# EAGLE design CHAIRCONTROLMOTORS (EAGLE 9.5.1)

## Sheet 1 of 2
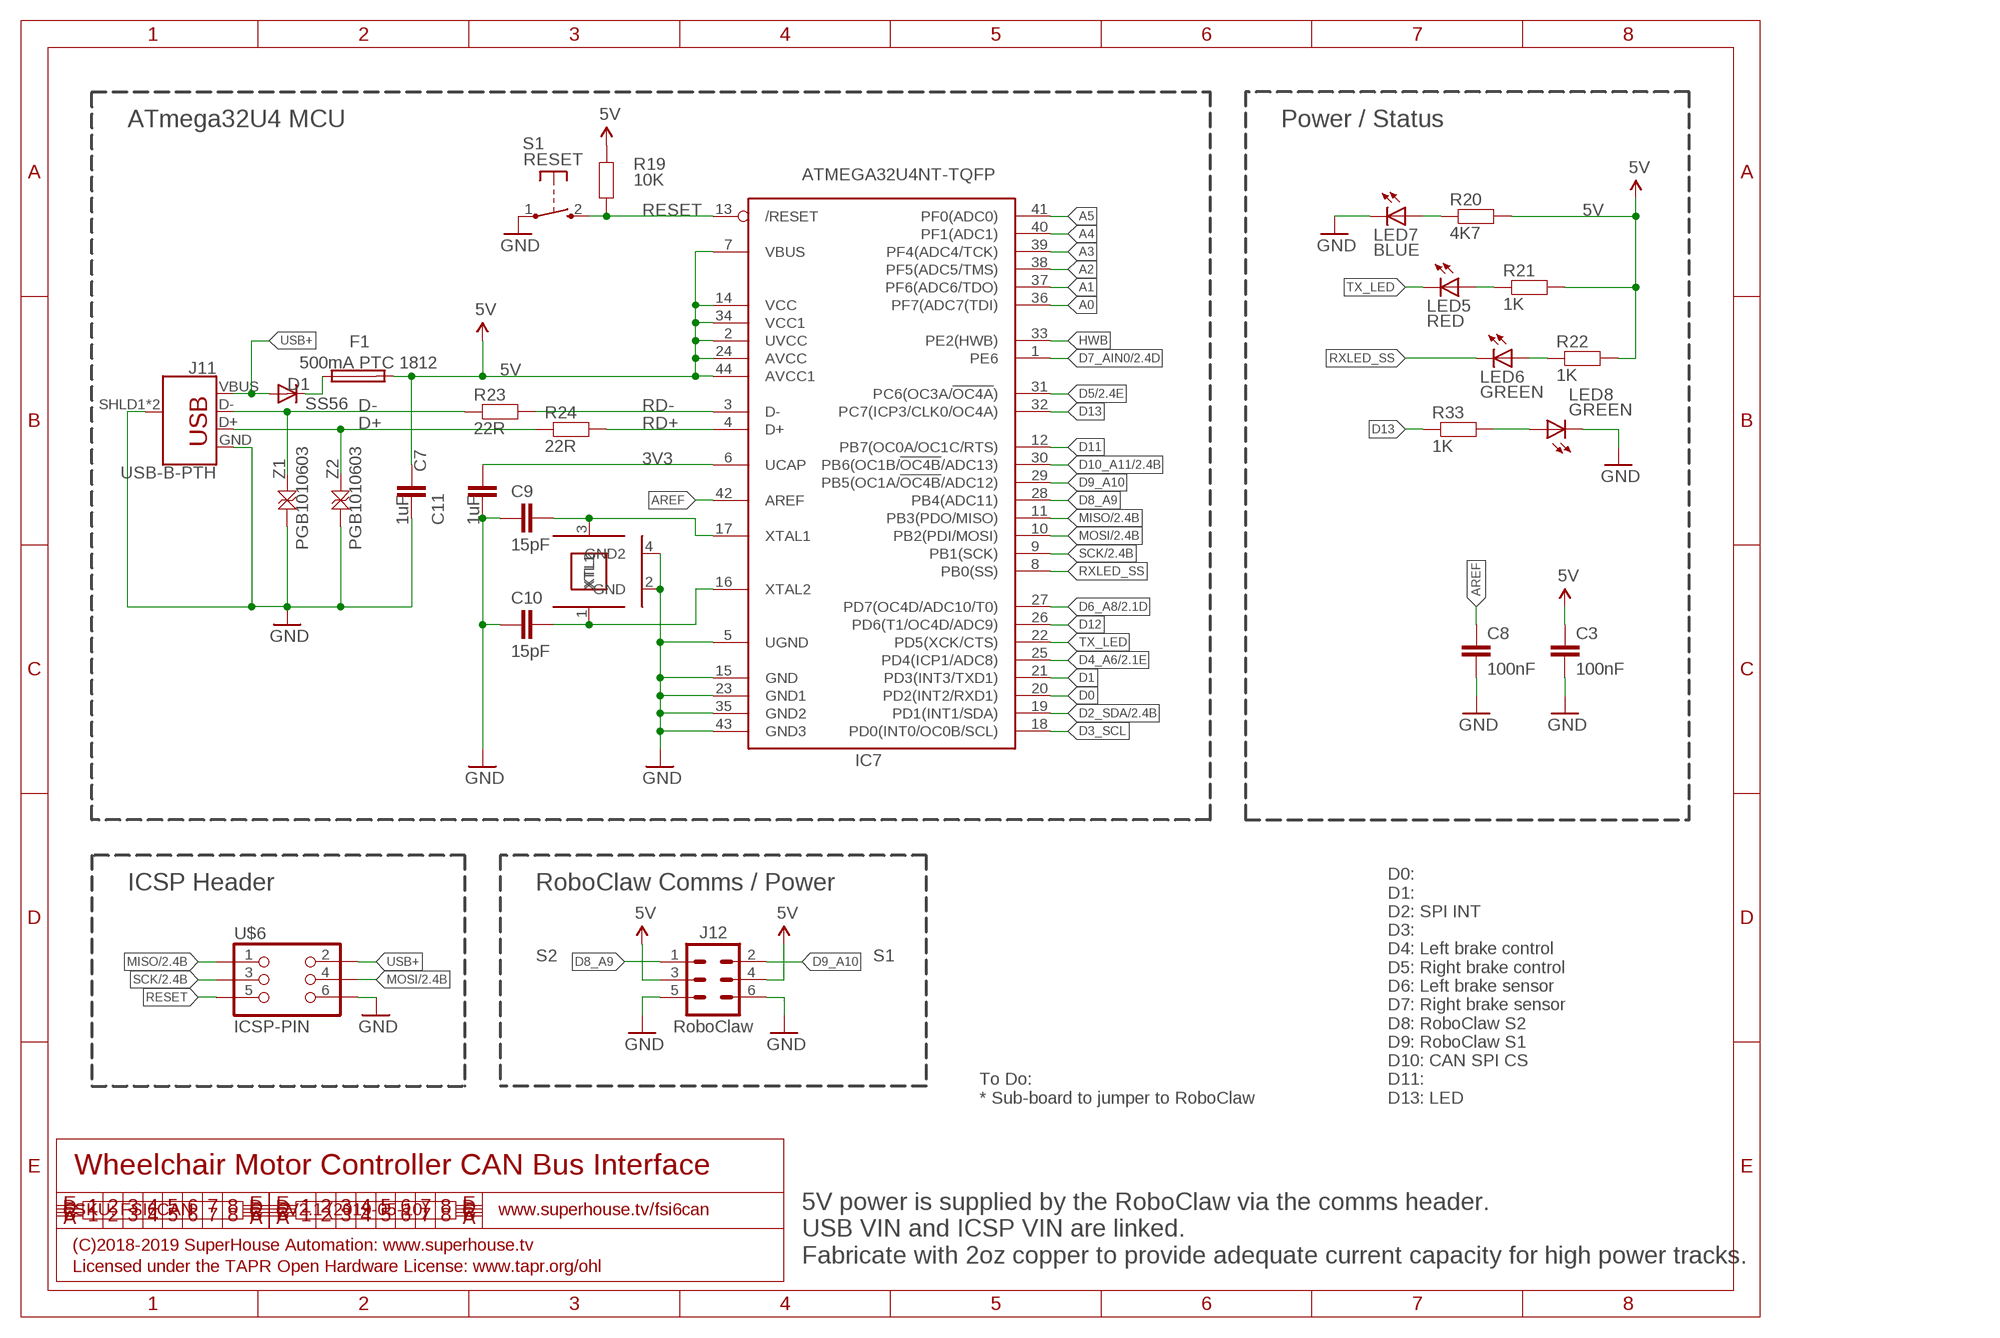
[diagram p0: schematic, sheet 1]

### Parts
C3  100nF  CAP0603  [C0603]
C7  1uF  CAP0603  [C0603]
C8  100nF  CAP0603  [C0603]
C9  15pF  CAP0603  [C0603]
C10  15pF  CAP0603  [C0603]
C11  1uF  CAP0603  [C0603]
D1  SS56  DIODESMA  [SMA-DIODE]
F1  500mA PTC 1812  PTC050  [1812]
IC7  ATMEGA32U4NT-TQFP  [TQFP44]
J11  USB-B-PTH  [USB-B-PTH]
J12  RoboClaw  M02X3-PIN  [2X03-P]
LED5  RED  LED0603  [LED-0603]
LED6  GREEN  LED0603  [LED-0603]
LED7  BLUE  LED0603  [LED-0603]
LED8  GREEN  LED0603  [LED-0603]
R19  10K  RESISTOR0603  [R0603]
R20  4K7  RESISTOR0603  [R0603]
R21  1K  RESISTOR0603  [R0603]
R22  1K  RESISTOR0603  [R0603]
R23  22R  RESISTOR0603  [R0603]
R24  22R  RESISTOR0603  [R0603]
R33  1K  RESISTOR0603  [R0603]
S1  RESET  TAC_SWITCH_2PINSMT  [TACTILE_SMT_3X4X2]
U$6  ICSP-PIN  [2X03-ICSP]
XTL2  16MHz  CRYSTAL-GND3X2  [CRYSTAL-SMD-3X2]
Z1  PGB1010603  TVS0603  [TVS0603]
Z2  PGB1010603  TVS0603  [TVS0603]

### Nets
3V3: C11.2 IC7.6(UCAP)
5V: C3.1 C7.1 F1.2 IC7.2(UVCC) IC7.7(VBUS) IC7.14(VCC) IC7.24(AVCC) IC7.34(VCC1) IC7.44(AVCC1) J12.3 J12.4 R19.2 R20.2 R21.2 R22.2 ; also sheet 2
A0: IC7.36(PF7(ADC7(TDI))
A1: IC7.37(PF6(ADC6/TDO))
A2: IC7.38(PF5(ADC5/TMS))
A3: IC7.39(PF4(ADC4/TCK))
A4: IC7.40(PF1(ADC1))
A5: IC7.41(PF0(ADC0))
AREF: C8.1 IC7.42(AREF)
D0: IC7.20(PD2(INT2/RXD1))
D1: IC7.21(PD3(INT3/TXD1))
D2_SDA: IC7.19(PD1(INT1/SDA)) ; also sheet 2
D3_SCL: IC7.18(PD0(INT0/OC0B/SCL))
D4_A6: IC7.25(PD4(ICP1/ADC8)) ; also sheet 2
D5: IC7.31(PC6(OC3A/!OC4A!)) ; also sheet 2
D6_A8: IC7.27(PD7(OC4D/ADC10/T0)) ; also sheet 2
D7_AIN0: IC7.1(PE6) ; also sheet 2
D8_A9: IC7.28(PB4(ADC11)) J12.1
D9_A10: IC7.29(PB5(OC1A/!OC4B!/ADC12)) J12.2
D10_A11: IC7.30(PB6(OC1B/!OC4B!/ADC13)) ; also sheet 2
D11: IC7.12(PB7(OC0A/OC1C/RTS))
D12: IC7.26(PD6(T1/OC4D/ADC9))
D13: IC7.32(PC7(ICP3/CLK0/OC4A)) R33.1
D+: J11.D+ R24.1 Z2.2
D-: J11.D- R23.1 Z1.2
GND: C3.2 C7.2 C8.2 C9.1 C10.1 C11.1 IC7.5(UGND) IC7.15(GND) IC7.23(GND1) IC7.35(GND2) IC7.43(GND3) J11.GND J11.SHLD1(SHIELD) J11.SHLD2(SHIELD) J12.5 J12.6 LED7.C LED8.C S1.1(P) U$6.6 XTL2.2(GND) XTL2.4(GND2) Z1.1 Z2.1 ; also sheet 2
HWB: IC7.33(PE2(HWB))
MISO: IC7.11(PB3(PDO/MISO)) U$6.1 ; also sheet 2
MOSI: IC7.10(PB2(PDI/MOSI)) U$6.4 ; also sheet 2
N$28: C9.2 IC7.17(XTAL1) XTL2.3(XTL2)
N$29: C10.2 IC7.16(XTAL2) XTL2.1(XTL1)
N$30: LED7.A R20.1
N$31: LED5.A R21.1
N$32: LED6.A R22.1
N$40: D1.C F1.1
N$43: LED8.A R33.2
RD+: IC7.4(D+) R24.2
RD-: IC7.3(D-) R23.2
RESET: IC7.13(/RESET) R19.1 S1.2(S) U$6.5
RXLED_SS: IC7.8(PB0(SS)) LED6.C
SCK: IC7.9(PB1(SCK)) U$6.3 ; also sheet 2
TX_LED: IC7.22(PD5(XCK/CTS)) LED5.C
USB+: D1.A J11.VBUS U$6.2

### Notes on the sheet
- ATmega32U4 MCU | Power / Status
- ICSP Header | RoboClaw Comms / Power
- S2 | S1
- To Do:
  * Sub-board to jumper to RoboClaw
- D0:
  D1:
  D2: SPI INT
  D3: 
  D4: Left brake control
  D5: Right brake control
  D6: Left brake sensor
  D7: Right brake sensor
  D8: RoboClaw S2
  D9: RoboClaw S1
  D10: CAN SPI CS
  D11: 
  D13: LED
- Wheelchair Motor Controller CAN Bus Interface
- SKU: FSI6CAN | V2.1 (2019-05-10) | www.superhouse.tv/fsi6can
- (C)2018-2019 SuperHouse Automation: www.superhouse.tv
- 5V power is supplied by the RoboClaw via the comms header.
  USB VIN and ICSP VIN are linked.
  Fabricate with 2oz copper to provide adequate current capacity for high power tracks.
- Licensed under the TAPR Open Hardware License: www.tapr.org/ohl

## Sheet 2 of 2
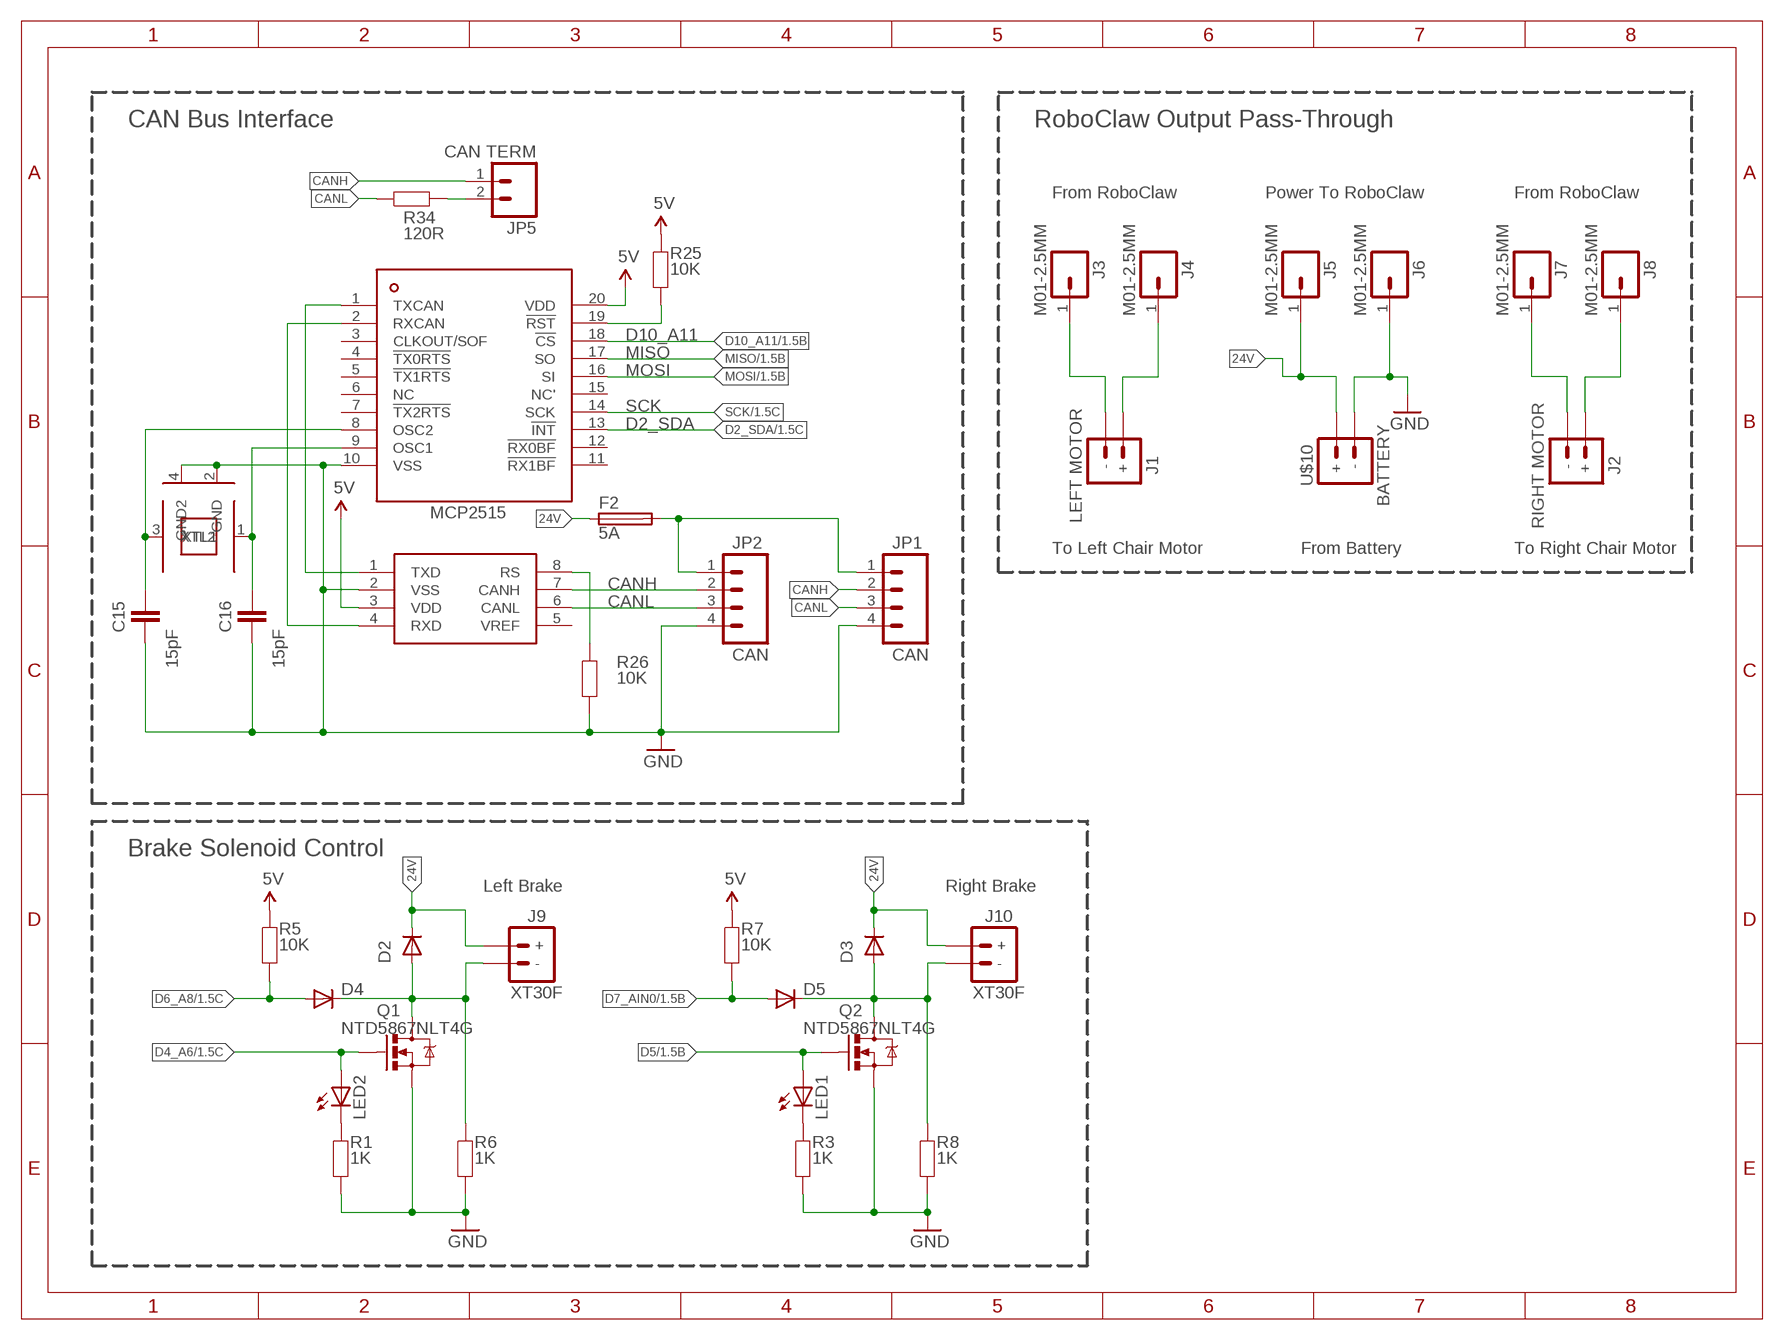
[diagram p1: schematic, sheet 2]

### Parts
C15  15pF  CAP0603  [C0603]
C16  15pF  CAP0603  [C0603]
D2  DIODESMA  [SMA-DIODE]
D3  DIODESMA  [SMA-DIODE]
D4  DIODESOD  [SOD-323]
D5  DIODESOD  [SOD-323]
F2  5A  FUSE  [MCCQ-122]
IC5  MCP2551  [SO08]
IC6  MCP2515  [TSSOP20]
J1  LEFT MOTOR  XTXX-60F  [XT60PW-F]
J2  RIGHT MOTOR  XTXX-60F  [XT60PW-F]
J3  M01-2.5MM  [1X01-2.5MM]
J4  M01-2.5MM  [1X01-2.5MM]
J5  M01-2.5MM  [1X01-2.5MM]
J6  M01-2.5MM  [1X01-2.5MM]
J7  M01-2.5MM  [1X01-2.5MM]
J8  M01-2.5MM  [1X01-2.5MM]
J9  XT30F  XTXX-30F  [XT30PW-F]
J10  XT30F  XTXX-30F  [XT30PW-F]
JP1  CAN  M04-PIN  [1X04-P]
JP2  CAN  M04-PIN  [1X04-P]
JP5  CAN TERM  M02-PIN  [1X02-P]
LED1  LED0603  [LED-0603]
LED2  LED0603  [LED-0603]
Q1  NTD5867NLT4G  MOSFET-NCHANNEL-DPAK  [DPACK]
Q2  NTD5867NLT4G  MOSFET-NCHANNEL-DPAK  [DPACK]
R1  1K  RESISTOR0603  [R0603]
R3  1K  RESISTOR0603  [R0603]
R5  10K  RESISTOR0603  [R0603]
R6  1K  RESISTOR0603  [R0603]
R7  10K  RESISTOR0603  [R0603]
R8  1K  RESISTOR0603  [R0603]
R25  10K  RESISTOR0603  [R0603]
R26  10K  RESISTOR0603  [R0603]
R34  120R  RESISTOR0603  [R0603]
U$10  BATTERY  XTXX-90M  [XT90PW-M]
XTL4  16MHz  CRYSTAL-GND3X2  [CRYSTAL-SMD-3X2]

### Nets
5V: IC5.3(VDD) IC6.20(VDD) R5.2 R7.2 R25.2 ; also sheet 1
24V: D2.C D3.C F2.1 F2.2 J5.1 J9.+ J10.+ U$10.+
CANH: IC5.7(CANH) JP1.2 JP2.2 JP5.1
CANL: IC5.6(CANL) JP1.3 JP2.3 R34.1
D2_SDA: IC6.13(!INT) ; also sheet 1
D4_A6: LED2.A Q1.1(G) ; also sheet 1
D5: LED1.A Q2.1(G) ; also sheet 1
D6_A8: D4.2(A) R5.1 ; also sheet 1
D7_AIN0: D5.2(A) R7.1 ; also sheet 1
D10_A11: IC6.18(!CS) ; also sheet 1
GND: C15.1 C16.1 IC5.2(VSS) IC6.10(VSS) J6.1 JP1.4 JP2.4 Q1.3(S) Q2.3(S) R1.1 R3.1 R6.1 R8.1 R26.1 U$10.- XTL4.2(GND) XTL4.4(GND2) ; also sheet 1
LEFT_BRAKE: D2.A D4.1(C) J9.- Q1.2(D) R6.2
MISO: IC6.17(SO) ; also sheet 1
MOSI: IC6.16(SI) ; also sheet 1
N$1: LED2.C R1.2
N$2: F2.3 F2.4 JP1.1 JP2.1
N$3: J1.+ J4.1
N$5: LED1.C R3.2
N$9: J1.- J3.1
N$14: J2.- J7.1
N$15: J2.+ J8.1
N$33: IC6.19(!RST) R25.1
N$34: IC5.1(TXD) IC6.1(TXCAN)
N$35: IC5.4(RXD) IC6.2(RXCAN)
N$36: IC5.8(RS) R26.2
N$37: C15.2 IC6.8(OSC2) XTL4.3(XTL2)
N$38: C16.2 IC6.9(OSC1) XTL4.1(XTL1)
N$44: JP5.2 R34.2
RIGHT_BRAKE: D3.A D5.1(C) J10.- Q2.2(D) R8.2
SCK: IC6.14(SCK) ; also sheet 1
Unconnected: IC5.5(VREF) IC6.3(CLKOUT/SOF) IC6.4(!TX0RTS) IC6.5(!TX1RTS) IC6.6(NC) IC6.7(!TX2RTS) IC6.11(!RX1BF) IC6.12(!RX0BF) IC6.15(NC')

### Notes on the sheet
- CAN Bus Interface | RoboClaw Output Pass-Through
- From RoboClaw | Power To RoboClaw | From RoboClaw
- To Left Chair Motor | From Battery | To Right Chair Motor
- Brake Solenoid Control
- Left Brake | Right Brake

## Library data of the parts
C3 C7-C11 C15 C16 = SuperHouse-DiscreteSemi:CAP: Capacitor Standard ceramic capacitor
D1-D5 = SuperHouse-DiscreteSemi:DIODE: Diode Standard reverse protection diodes and small signal diodes. SMA package can handle up to about 1A. SOD-323 can handle about 200mA.
F1 = SuperHouse-Fuses:PTC: MF-SMDF Series - PRC Resettable Fuses Source: http://www.farnell.com/datasheets/716597.pdf
F2 = SuperHouse-Fuses:FUSE
IC5 = SuperHouse-ICs:MCP2551: CAN bus transceiver. Pin compatible chips with different specs include: MCP2551 (5V only) TCAN332DR (3.3V)
IC6 = SuperHouse-ICs:MCP2515: Microchip Technology’s MCP2515 is a stand-alone Controller Area Network (CAN) controller that implements the CAN specification, version 2.0B. It is capable of transmitting and receiving both standard and extended data and remote frames. The MCP2515 has two acceptance masks and six acceptance filters that are used to filter out unwanted messages, thereby reducing the host MCUs overhead. The MCP2515 interfaces with microcontrollers (MCUs) via an industry standard Serial Peripheral Interface (SPI).
IC7 = SuperHouse-MCUs:ATMEGA32U4NT: ATmega32u4 MCU
J1 J2 J9 J10 U$10 = SuperHouse-Connectors:XTXX: XT30/60/90 connector
J3-J8 = SuperHouse-Connectors:M01: 1-way header Standard 1x1 header
J11 = SuperHouse-Connectors:USB-B: USB Type B Connector
J12 = SuperHouse-Connectors:M02X3: 0.1" header, 2x3 (6-way)
JP1 JP2 = SuperHouse-Connectors:M04: 4-way header Standard 1x4 header, and screw terminal variations
JP5 = SuperHouse-Connectors:M02: 2-way header Standard 1x2 header, and screw terminal variations
LED1 LED2 LED5-LED8 = SuperHouse-LEDs:LED: LEDs Standard schematic elements and footprints for 5mm, 3mm, 1206, and 0603 sized LEDs. 5mm - Spark Fun Electronics SKU : COM-00529 (and others)
Q1 Q2 = SuperHouse-DiscreteSemi:MOSFET-NCHANNEL: N-channel MOSFET
R1 R3 R5-R8 R19-R26 R33 R34 = SuperHouse-DiscreteSemi:RESISTOR: Resistor Standard resistors.
S1 = SuperHouse-Switches:TAC_SWITCH_2PIN: Momentary Tactile Switch - 2 pin Uxcell 3x4x2mm switch with 2 SMT pads
U$6 = SuperHouse-Connectors:ICSP
XTL2 XTL4 = SuperHouse-Oscillators:CRYSTAL-GND: 3x2mm SMT crystal
Z1 Z2 = SuperHouse-DiscreteSemi:TVS: TVS voltage protection Zener

## Board
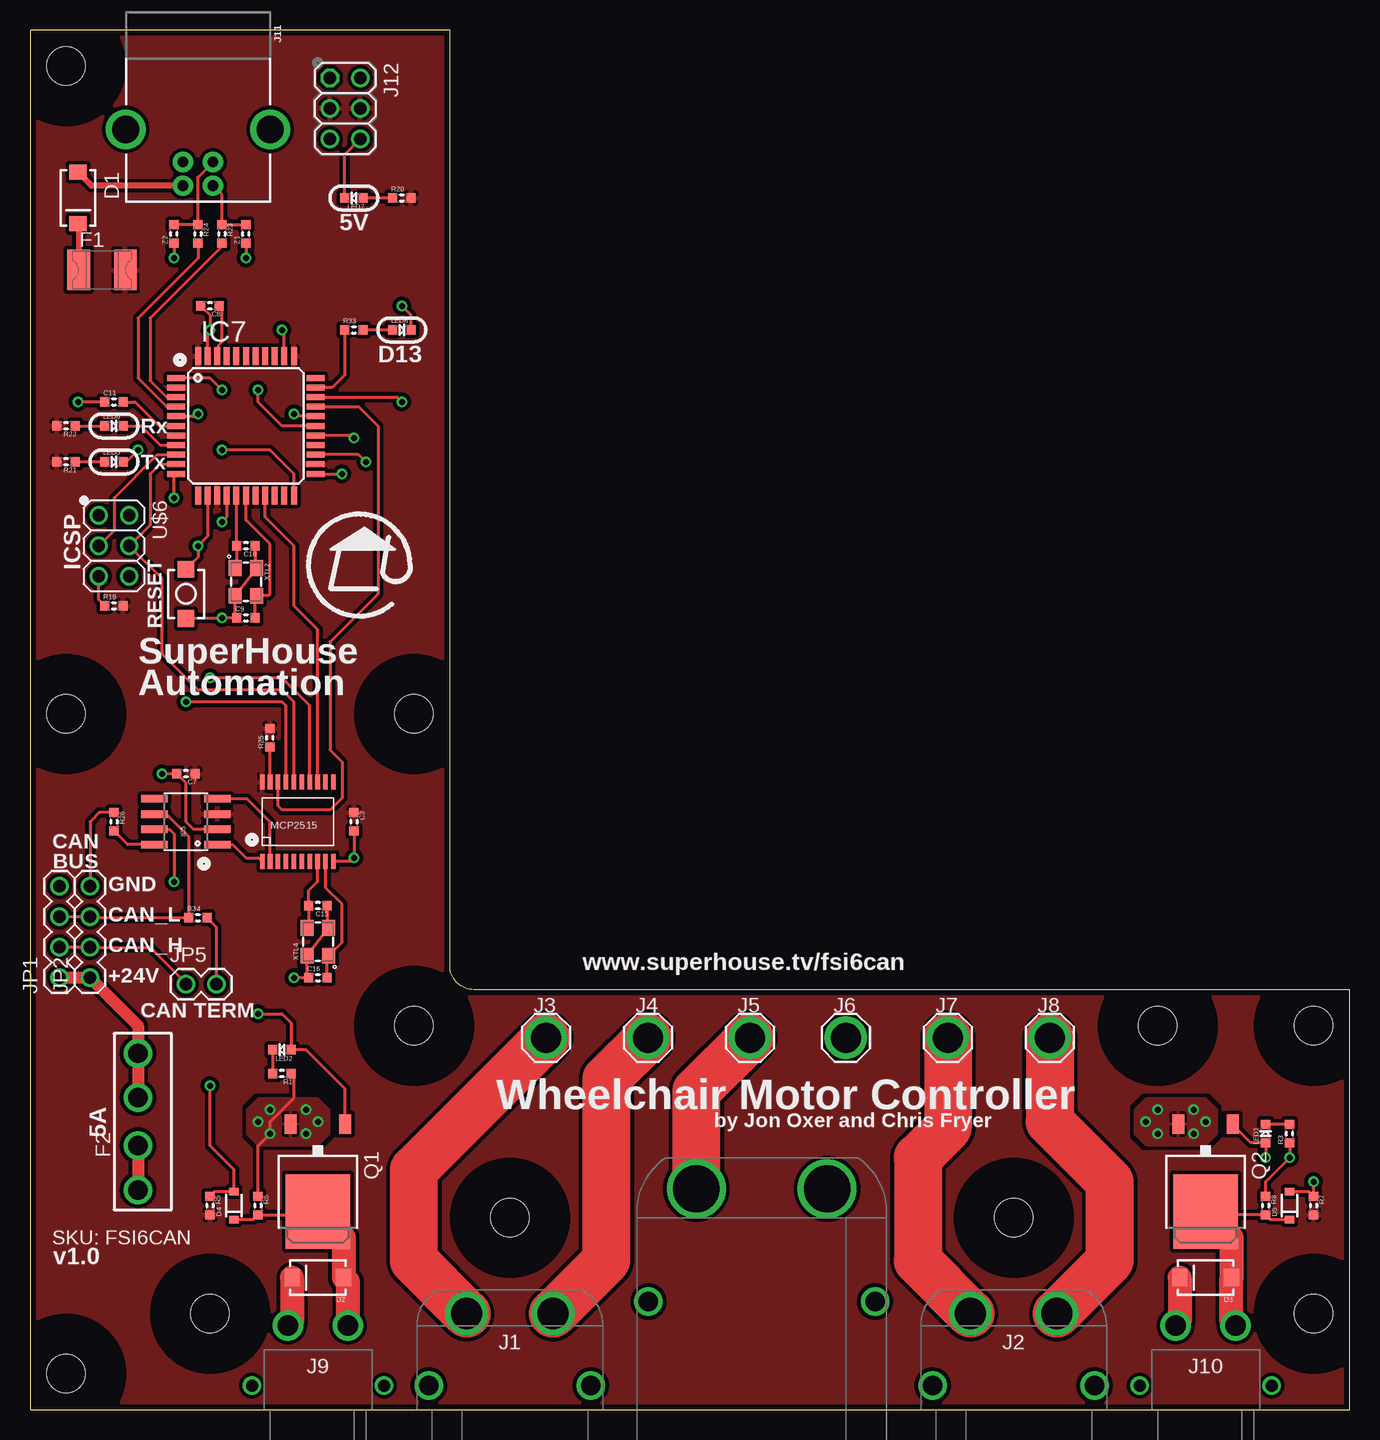
[diagram p2: board, top side]
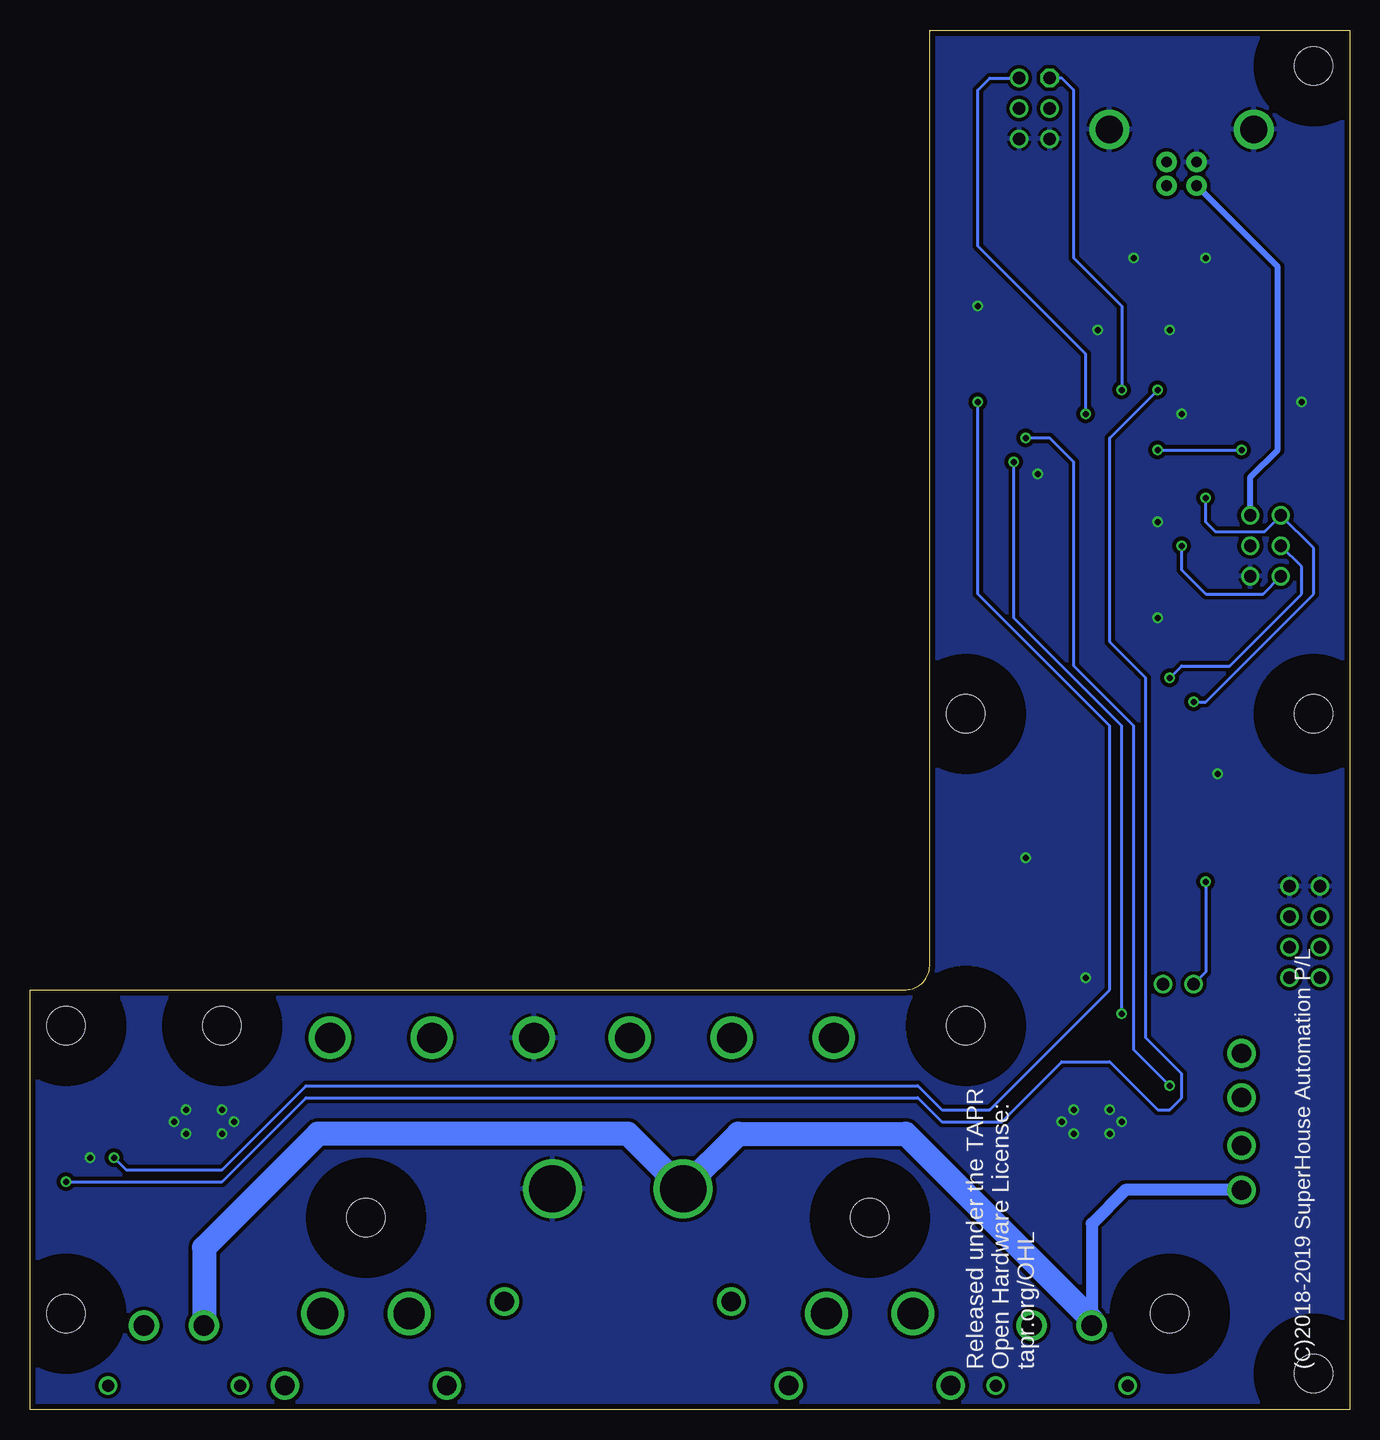
[diagram p3: board, bottom side, seen from below]

Size 110 x 115 mm. Coordinates in mm from the lower left corner, seen from the top.
Outline: 35,37 35,115 0,115 0,0 110,0 110,35 37,35 arc-90 35,37
Copper layers (1*16): Top 0.035mm / dielectric 1.5mm / Bottom 0.035mm
Design rules "default *": minimum track width 10mil, minimum drill 0.5mm, track to track 12mil, track to pad 12mil, pad to pad 12mil, via to via 12mil, smd to smd 8mil, copper to edge 18mil, drill to drill 8mil, minimum pad ring 10mil, minimum via ring 8mil, stop-mask expansion 0.4mm, vias tented up to drill 0.7mm, thermal gap 10mil
Holes 3.2 mm at 107,32 32,32 107,8 3,3 15,8 3,112 3,58 32,58 40,16 82,16 94,32
tRestrict: area 37,13 to 43,19; area 29,29 to 35,35; area 104,29 to 110,35; area 79,13 to 85,19; area 104,5 to 110,11; area 12,5 to 18,11; area 91,29 to 97,35; area 0,109 to 6,115; area 0,0 to 6,6; area 29,55 to 35,61; area 0,55 to 6,61
bRestrict: area 0,0 to 6,6; area 104,29 to 110,35; area 104,5 to 110,11; area 91,29 to 97,35; area 79,13 to 85,19; area 37,13 to 43,19; area 29,29 to 35,35; area 12,5 to 18,11; area 0,109 to 6,115; area 29,55 to 35,61; area 0,55 to 6,61

### Footprints (pad centres in the part's own frame; a part is rotated, then mirrored left to right if it is on the bottom)
C0603 = smd 0.762 x 0.762: 1 -0.762,0; 2 0.762,0
SMA-DIODE = smd 1.27 x 1.47: A -2.15,0; C 2.15,0
SOD-323 = smd 0.63 x 0.83: 1 -1.15,0; 2 1.15,0
1812 = smd 1.9 x 3.4: 1 -1.95,0; 2 1.95,0
MCCQ-122 = drill 1.6: 1 -5.7,0; 2 -2,0; 3 2,0; 4 5.7,0
SO08 = smd 0.61 x 2.21: 1 -1.905,-2.616; 2 -0.635,-2.616; 3 0.635,-2.616; 4 1.905,-2.616; 5 1.905,2.616; 6 0.635,2.616; 7 -0.635,2.616; 8 -1.905,2.616
TSSOP20 = smd 1.27 x 0.381: 1 -3.302,2.642; 2 -3.302,1.981; 3 -3.302,1.321; 4 -3.302,0.66; 5 -3.302,0; 6 -3.302,-0.66; 7 -3.302,-1.321; 8 -3.302,-1.981; 9 -3.302,-2.642; 10 -3.302,-3.302; 11 3.302,-3.302; 12 3.302,-2.642; 13 3.302,-1.981; 14 3.302,-1.321; 15 3.302,-0.66; 16 3.302,0; 17 3.302,0.66; 18 3.302,1.321; 19 3.302,1.981; 20 3.302,2.642
TQFP44 = smd 1.5 x 0.5: 1 -5.8,4; 2 -5.8,3.2; 3 -5.8,2.4; 4 -5.8,1.6; 5 -5.8,0.8; 6 -5.8,0; 7 -5.8,-0.8; 8 -5.8,-1.6; 9 -5.8,-2.4; 10 -5.8,-3.2; 11 -5.8,-4; 23 5.8,-4; 24 5.8,-3.2; 25 5.8,-2.4; 26 5.8,-1.6; 27 5.8,-0.8; 28 5.8,0; 29 5.8,0.8; 30 5.8,1.6; 31 5.8,2.4; 32 5.8,3.2; 33 5.8,4 | smd 0.5 x 1.5: 12 -4,-5.8; 13 -3.2,-5.8; 14 -2.4,-5.8; 15 -1.6,-5.8; 16 -0.8,-5.8; 17 0,-5.8; 18 0.8,-5.8; 19 1.6,-5.8; 20 2.4,-5.8; 21 3.2,-5.8; 22 4,-5.8; 34 4,5.8; 35 3.2,5.8; 36 2.4,5.8; 37 1.6,5.8; 38 0.8,5.8; 39 0,5.8; 40 -0.8,5.8; 41 -1.6,5.8; 42 -2.4,5.8; 43 -3.2,5.8; 44 -4,5.8
XT60PW-F = drill 2.6: + 3.6,6; - -3.6,6 | drill 1.6: P$1 -6.75,0; P$2 6.75,0
1X01-2.5MM = drill 2.5: 1 0,0
XT30PW-F = drill 1.7: + -2.5,5; - 2.5,5 | drill 1: P$1 -5.5,0; P$2 5.5,0
USB-B-PTH = drill 0.914 pad 1.676: D+ 4,1.25; D- 5.981,1.25; GND 4,-1.25; VBUS 5.981,-1.25 | drill 2.286: SHLD1 1.282,-6.02; SHLD2 1.282,6.02
2X03-P = drill 1.016 octagon: 1 0,0 | drill 1.016: 2 0,2.54; 3 2.54,0; 4 2.54,2.54; 5 5.08,0; 6 5.08,2.54
1X04-P = drill 1.016: 1 0,0; 2 2.54,0; 3 5.08,0; 4 7.62,0
1X02-P = drill 1.016: 1 0,0; 2 2.54,0
LED-0603 = smd 0.762 x 0.762: A -0.762,0; C 0.762,0
DPACK = smd 1 x 1.6: 1 -2.28,-4.8; 3 2.28,-4.8 | smd 5.4 x 6.2: 2 0,2.5
R0603 = smd 0.762 x 0.762: 1 -0.762,0; 2 0.762,0
TACTILE_SMT_3X4X2 = smd 1.4 x 1.4: 1 -2.05,0; 2 2.05,0
2X03-ICSP = drill 1.016: 1 -2.54,-1.27; 2 -2.54,1.27; 3 0,-1.27; 4 0,1.27; 5 2.54,-1.27; 6 2.54,1.27
XT90PW-M = drill 3.9: + -5.45,9.4; - 5.45,9.4 | drill 1.6: P$1 -9.45,0; P$2 9.45,0
CRYSTAL-SMD-3X2 = smd 1.3 x 1.1: 1 -1.15,-0.9; 2 1.15,-0.9; 3 1.15,0.9; 4 -1.15,0.9
TVS0603 = smd 0.762 x 0.762: 1 -0.762,0; 2 0.762,0

### Placement (x,y rotation side)
C3  27,49 270 top
C7  13,53 180 top
C8  15,92 180 top
C9  18,66 0 top
C10  18,72 180 top
C11  7,84 0 top
C15  24,42 180 top
C16  24,36 0 top
D1  4,101 270 top
D2  24,11 180 top
D3  98,11 180 top
D4  17,17 90 top
D5  105,17 90 top
F1  6,95 0 top
F2  9,24 90 top
IC5  13,49 90 top
IC6  22,49 90 top
IC7  18,82 0 top
J1  40,2 0 top
J2  82,2 0 top
J3  43,31 0 top
J4  51.5,31 0 top
J5  60,31 0 top
J6  68,31 0 top
J7  76.5,31 0 top
J8  85,31 0 top
J9  24,2 0 top
J10  98,2 0 top
J11  14,108 270 top
J12  25,111 270 top
JP1  2.46,36 90 top
JP2  5,36 90 top
JP5  13,35.46 0 top
LED1  103,23 90 top
LED2  21,30 180 top
LED5  7,79 0 top
LED6  7,82 0 top
LED7  27,101 180 top
LED8  31,90 0 top
Q1  24,19 180 top
Q2  98,19 180 top
R1  21,28 180 top
R3  105,23 90 top
R5  15,17 270 top
R6  19,17 270 top
R7  107,17 270 top
R8  103,17 270 top
R19  7,67 0 top
R20  31,101 0 top
R21  3,79 180 top
R22  3,82 180 top
R23  16,98 270 top
R24  14,98 270 top
R25  20,56 90 top
R26  7,49 270 top
R33  27,90 0 top
R34  14,41 0 top
S1  13,68 90 top
U$6  7,72 270 top
U$10  61,9 0 top
XTL2  18,69 270 top
XTL4  24,39 90 top
Z1  18,98 90 top
Z2  12,98 90 top

### Tracks (layer width: path | path; a pad name or v marks a point on that pad's centre or on a via)
3V3
  Top 0.254: C11.2 8.76,84 10.76,82 IC7.6
5V
  pour Top (rank 3): 35,37 arc90 37,35 110,35 110,0 0,0 0,115 35,115
24V
  Top 1.016: F2.2 F2.1
  Top 2: D3.C 95.85,7.35 J10.+ | D2.C 21.85,7.35 J9.+
  Top 4: U$10.+ 55.55,26.55 J5.1
  Bottom 1.016: F2.1 18.7,18.3 21.5,15.5 21.5,7.5
  Bottom 2: J10.+ 95.5,13.5 86,23 60.15,23 U$10.+ 50.95,23 37,23 21.5,7.5 J9.+
AREF
  Top 0.254: IC7.42 15.72,87.92 15.72,88.73 16,89.01 16,91.76 C8.1
CANH  (via drill 0.5)
  Top 0.254: JP5.1 13,35.54 10,38.54 JP2.2 JP1.2 | IC5.7 11.63,48.37 12,48 v12,44
  Bottom 0.254: v12,44 12,36.46 JP5.1
CANL
  Top 0.254: IC5.6 11.37,49.63 13.24,47.76 R34.1 5.08,41 JP2.3 JP1.3
D2_SDA
  Top 0.254: IC6.13 23.98,65.02 22,67 22,72 19.6,74.4 IC7.19
D4_A6  (via drill 0.5)
  Top 0.254: v28,79 27.4,79.6 IC7.25 | v19,33 21,33 21.76,32.24 LED2.A 23,30 26.28,26.72 Q1.1
  Bottom 0.254: v19,33 19,57 28,66 v28,79
D5  (via drill 0.5)
  Top 0.254: IC7.31 30.6,84.4 v31,84 | 100.32,23.76 Q2.1 100.28,23.72 101.76,22.24 LED1.A v103,21
  Bottom 0.254: v103,21 102,20 94,20 87,27 36,27 34,25 30,25 20,35 20,57 31,68 v31,84
D6_A8  (via drill 0.5)
  Top 0.254: R5.1 15.39,18.15 D4.2 17,20 15,22 v15,27 | v27,81 26.8,81.2 IC7.27
  Bottom 0.254: v15,27 18,30 18,57 23,62 23,79 25,81 v27,81
D7_AIN0  (via drill 0.5)
  Top 0.254: D5.2 106.61,18.15 R7.1 v107,19 | v16,85 15,86 IC7.1
  Bottom 0.254: v107,19 94,19 87,26 36,26 34,24 29,24 24,29 20,29 16,25 15,25 14,26 14,28 17,31 17,61 20,64 20,81 v16,85
D8_A9  (via drill 0.5)
  Top 0.254: IC7.28 21,82 19,84 v19,85
  Bottom 0.254: J12.1 24,111 23,110 23,96 19,92 v19,85
D9_A10  (via drill 0.5)
  Top 0.254: IC7.29 22.2,82.8 v22,83
  Bottom 0.254: v22,83 22,88 31,97 31,110 30,111 J12.2
D10_A11
  Top 0.254: IC7.30 27.4,83.6 29,82 29,68 25,64 25,55 26,54 26,51 25,50 21,50 20.68,50.32 IC6.18
D13
  Top 0.254: R33.1 26.24,86.24 25.2,85.2 IC7.32
D+
  Top 0.254: Z2.2 R24.1 14,102.75 J11.D+
D-
  Top 0.254: Z1.2 R23.1 16,101.27 J11.D-
GND  (via drill 0.5)
  Top 0.254: R1.1 22,28 22,26 20,24 v20,23 19,22 R6.1 | C15.1 24.76,40.29 XTL4.2 XTL4.4 23.1,36.14 C16.1 v22,36 | C3.2 v27,46 26.7,45.7 IC6.10 | IC5.2 13.63,48.37 13,49 13,52.24 C7.2 v11,53 | R26.1 5.76,49.76 5,49 JP2.4 | C10.1 18.76,70.29 XTL2.4 XTL2.2 17.1,66.14 C9.1 v16,66 13.05,66 S1.1 | IC7.15 16.4,74.4 v16,74 | IC7.23 v26,78 | IC7.43 14.8,89.8 v15,90 15,91.24 C8.2 | IC7.35 21.2,89.8 v21,90 | R8.1 103,19 v105,21 R3.1 | C11.1 v4,84 | LED7.C 26.24,104.62 J12.6 | LED8.C 31.76,91.24 v31,92 | Z2.1 v12,96 | Z1.1 v18,96 | IC7.5 13.8,82.8 v14,83
  other vias: 94,25 93,24 94,23 97,25 98,24 97,23 20,25 19,24 23,23 24,24 23,25
  pour Bottom: 35,37 arc90 37,35 110,35 110,0 0,0 0,115 35,115
  pour Top (rank 2): 93,26 92,25 92,24 92,23 93,22 94,22 95,22 98,22 99,23 99,25 98,26
  pour Top: 18,25 18,23 19,22 24,22 25,23 25,25 24,26 19,26
LEFT_BRAKE
  Top 0.254: D4.1 18.61,15.85 R6.2 23.24,16.24 24,17 Q1.2
  Top 2: J9.- 26.5,10.65 D2.A 26.15,14.35 Q1.2
MISO  (via drill 0.5)
  Top 0.254: IC6.17 21.34,58.66 21,59 v13,59 | v12,76 12,77.8 IC7.11
  Bottom 0.254: v13,59 12,59 3,68 3,71.81 U$6.1 7.08,73.19 11.19,73.19 12,74 v12,76
MOSI
  Top 0.254: IC6.16 22,59 21,60 14,60 11,63 11,69.27 U$6.4 10,73.73 10,78 10.8,78.8 IC7.10
N$1
  Top 0.254: LED2.C R1.2
N$2
  Top 1.016: F2.3 F2.4 9,32 JP2.1 JP1.1
N$3
  Top 4: J4.1 48.06,27.56 48.06,12.46 J1.+
N$5
  Top 0.254: R3.2 LED1.C
N$9
  Top 4: J1.- 32,12.4 32,20 J3.1
N$14
  Top 4: J2.- 74,12.4 74,21 76.5,23.5 J7.1
N$15
  Top 4: J2.+ 90,12.4 90,19 85,24 J8.1
N$28
  Top 0.254: C9.2 18.76,67.71 XTL2.3 19.85,67.85 20,68 20,72.14 18,74.14 IC7.17
N$29
  Top 0.254: XTL2.1 17.24,70.29 C10.2 17.2,72.04 IC7.16
N$30
  Top 0.254: R20.1 LED7.A
N$31
  Top 0.254: LED5.A R21.1
N$32
  Top 0.254: R22.1 LED6.A
N$33
  Top 0.254: IC6.19 20,52.32 R25.1
N$34
  Top 0.254: IC6.1 19.06,46 18,46 16.91,47.09 IC5.1
N$35
  Top 0.254: IC6.2 20,45.72 20,49 18.09,50.91 IC5.4
N$36
  Top 0.254: IC5.8 8.14,47.09 R26.2
N$37
  Top 0.254: XTL4.3 23.24,40.29 C15.2 23.24,43.28 23.98,44.02 IC6.8
N$38
  Top 0.254: C16.2 24.76,37.71 XTL4.1 26,38.95 26,42.13 24.64,43.49 IC6.9
N$40
  Top 0.508: D1.C 4.05,98.8 F1.1
N$43
  Top 0.254: LED8.A R33.2
N$44
  Top 0.254: R34.2 15.54,40.22 JP5.2
RD+
  Top 0.254: R24.2 14,96 9,91 9,85.99 11.39,83.6 IC7.4
RD-
  Top 0.254: R23.2 16,97 10,91 10,85.79 11.39,84.4 IC7.3
RESET  (via drill 0.5)
  Top 0.254: IC7.13 14.8,72.8 v14,72 14,71.05 S1.2 | R19.1 5.73,67.51 U$6.5
  Bottom 0.254: v14,72 14,70 12,68 7.19,68 U$6.5
RIGHT_BRAKE
  Top 0.254: D5.1 103.39,15.85 R8.2 98.76,16.24 98,17 Q2.2
  Top 2: J10.- 100.15,7.35 D3.A 100.15,14.35 Q2.2
RXLED_SS
  Top 0.254: LED6.C 9.25,82 10.85,80.4 IC7.8
SCK  (via drill 0.5)
  Top 0.254: IC6.14 23.32,58.68 21,61 v15,61 | IC7.9 10.6,79.6 7,76 7,73.27 U$6.3
  Bottom 0.254: v15,61 14,62 10,62 4,68 4,70.27 U$6.3
TX_LED  (via drill 0.5)
  Top 0.254: IC7.22 22,78 20,80 v16,80 | v9,80 8,79 LED5.C
  Bottom 0.254: v16,80 v9,80
USB+
  Top 0.508: J11.VBUS 5.13,102.02 D1.A
  Bottom 0.508: J11.VBUS 6,95.27 6,80 8.27,77.73 U$6.2

### Text on the board
tPlace: 5V | D13 | Rx | Tx | ICSP | RESET | SuperHouse / Automation | CAN / BUS | GND | CAN_L | CAN_H | www.superhouse.tv/fsi6can | +24V | CAN TERM | Wheelchair Motor Controller | 5A | by Jon Oxer and Chris Fryer | SKU: FSI6CAN | v1.0
bPlace: (C)2018-2019 SuperHouse Automation P/L | Released under the TAPR / Open Hardware License: / tapr.org/OHL